# EAGLE design VER2.0 (EAGLE 8.3.2)
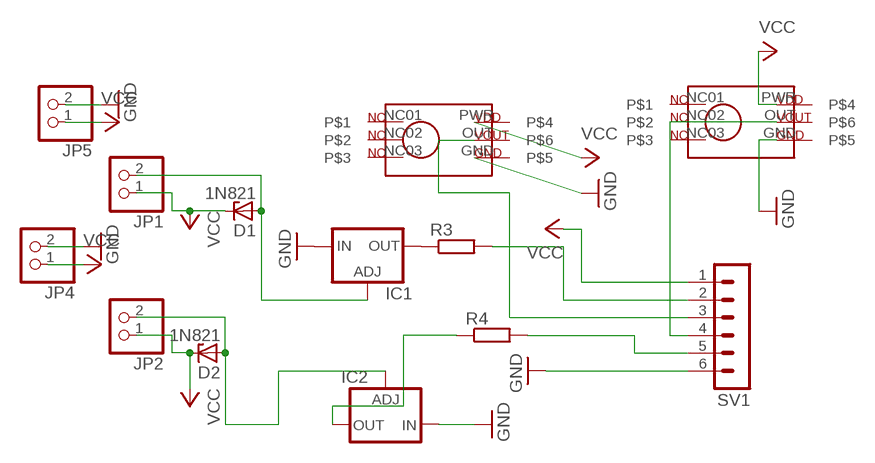
[diagram p0: schematic, sheet 1]

## Parts
D1  1N821  [DO35Z10]
D2  1N821  [DO35Z10]
IC1  LM317TS  [317TS]
IC2  LM317TS  [317TS]
JP1  PINHD-1X2  [1X02]
JP2  PINHD-1X2  [1X02]
JP4  PINHD-1X2  [1X02]
JP5  PINHD-1X2  [1X02]
R3  R-EU_0207/10  [0207/10]
R4  R-EU_0207/10  [0207/10]
SV1  MA06-1  [MA06-1]
U$1  MIS-2500  [MIS-2500]
U$2  MIS-2500  [MIS-2500]

## Nets
GND: IC1.3(IN) IC2.3(IN) JP4.2 JP5.2 SV1.6 U$1.GND U$2.GND
N$1: R3.2 SV1.2
N$2: SV1.3 U$1.OUT
N$3: IC2.2(OUT) R4.1
N$4: D2.A IC2.1(ADJ) JP2.2
N$5: IC1.2(OUT) R3.1
N$6: D1.A IC1.1(ADJ) JP1.2
N$8: SV1.4 U$2.OUT
N$9: R4.2 SV1.5
VCC: D1.C D2.C JP1.1 JP2.1 JP4.1 JP5.1 SV1.1 U$1.PWR U$2.PWR
Unconnected: U$1.NC01 U$1.NC02 U$1.NC03 U$2.NC01 U$2.NC02 U$2.NC03

## Library data of the parts
D1 D2 = diode:1N821: Reference DIODE temperature compensated, 6,2 V
IC1 IC2 = v-reg:LM317TS: VOLTAGE REGULATOR
JP1 JP2 JP4 JP5 = pinhead:PINHD-1X2: PIN HEADER
R3 R4 = resistor:R-EU_: RESISTOR, European symbol
SV1 = con-lstb:MA06-1: PIN HEADER; OC_FARNELL: unknown; OC_NEWARK: unknown
U$1 U$2 = mis-2500:MIS-2500

## Board
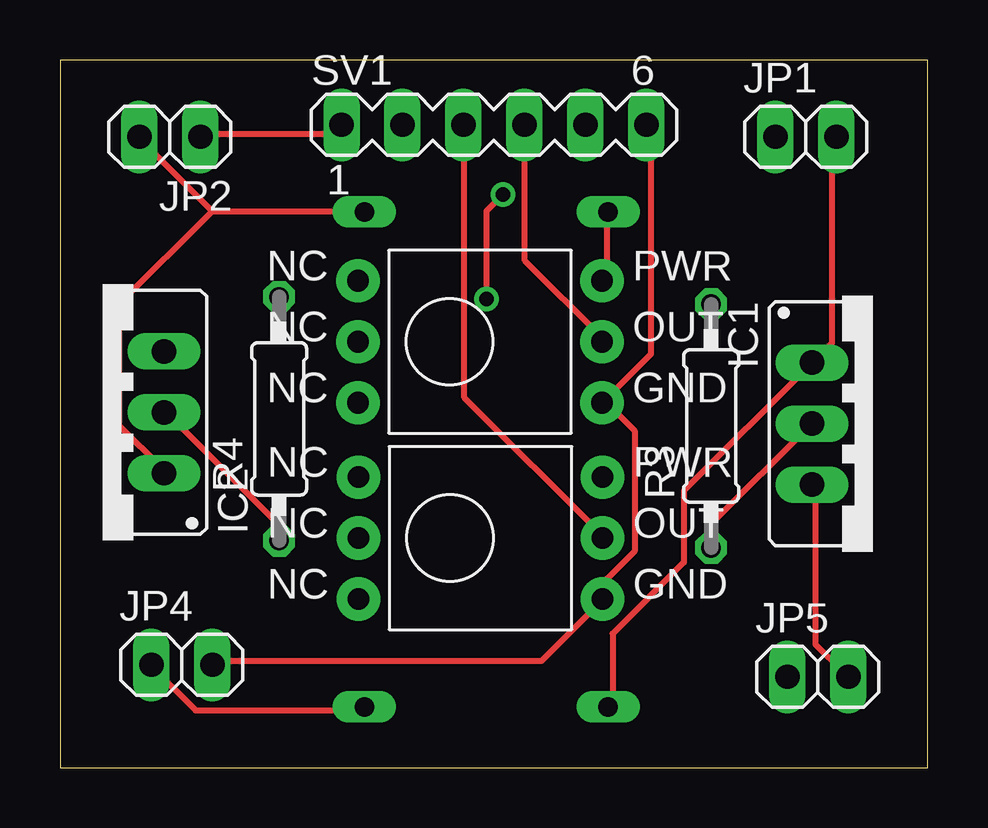
[diagram p1: board, top side]
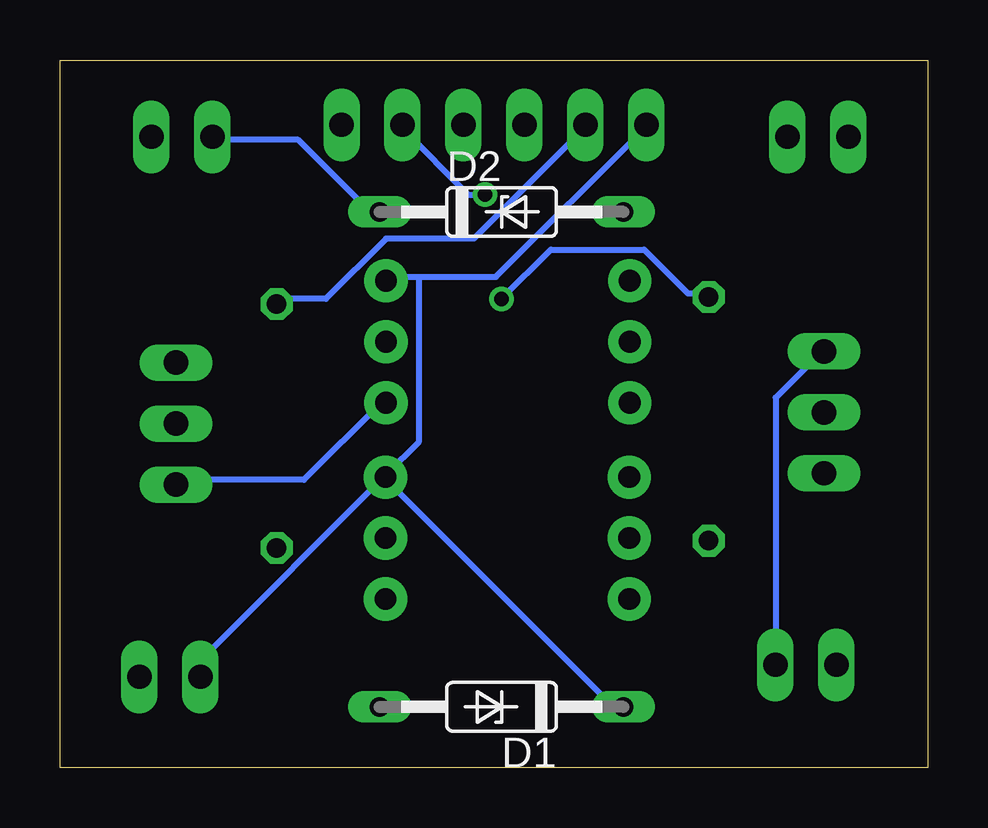
[diagram p2: board, bottom side, seen from below]

Size 36.16 x 29.48 mm. Coordinates in mm from the lower left corner, seen from the top.
Outline: 0,0 36.16,0 36.16,29.48 0,29.48 0,0
Copper layers (1*16): Top 0.035mm / dielectric 1.5mm / Bottom 0.035mm
Design rules "default": minimum track width 10mil, minimum drill 24mil, track to track 8mil, track to pad 8mil, pad to pad 8mil, via to via 8mil, smd to smd 8mil, copper to edge 40mil, drill to drill 8mil, minimum pad ring 10mil, minimum via ring 8mil, stop-mask expansion 4mil, vias tented up to drill 0mil, thermal gap 10mil

### Footprints (pad centres in the part's own frame; a part is rotated, then mirrored left to right if it is on the bottom)
DO35Z10 = drill 0.813 long: A 5.08,0; C -5.08,0
317TS = drill 1.016 long: 1 -2.54,-2.54; 2 0,-2.54; 3 2.54,-2.54
1X02 = drill 1.016 long: 1 -1.27,0; 2 1.27,0
0207/10 = drill 0.813 octagon: 1 -5.08,0; 2 5.08,0
MA06-1 = drill 1.016 long: 1 -6.35,0; 2 -3.81,0; 3 -1.27,0; 4 1.27,0; 5 3.81,0; 6 6.35,0
MIS-2500 = drill 0.9 pad 1.8: GND 0,-5.08; NC01 -10.16,0; NC02 -10.16,-2.54; NC03 -10.16,-5.08; OUT 0,-2.54; PWR 0,0

### Placement (x,y rotation side)
D1  17.76,2.53 180 bottom
D2  17.76,23.15 0 bottom
IC1  33.87,14.33 270 top
IC2  1.79,14.8 90 top
JP1  31.08,26.28 0 top
JP2  4.58,26.28 180 top
JP4  5.08,4.28 0 top
JP5  31.58,3.78 0 top
R3  27.13,14.23 90 top
R4  9.13,14.53 90 top
SV1  18.08,26.78 0 top
U$1  22.6,12.1 0 top
U$2  22.58,20.28 0 top

### Tracks (layer width: path | path; a pad name or v marks a point on that pad's centre or on a via)
GND
  Top 0.254: IC1.3 31.48,11.75 31.48,5.12 32.63,3.98 JP5.2 | SV1.6 24.63,26.61 24.63,17.24 22.8,15.41 U$2.GND 22.8,15.18 23.94,14.04 23.94,9.01 22.8,7.87 22.8,7.18 U$1.GND 22.57,6.95 20.05,4.44 6.57,4.44 JP4.2
  Bottom 0.254: JP4.2 6.34,4.44 6.34,15.41 4.51,17.24 IC2.3 | IC1.3 31.26,11.98 26,11.98 22.8,15.18 U$2.GND
N$1
  Bottom 0.254: R3.2 26.91,19.53 25.08,19.53 22.57,22.04 18.91,22.04 14.34,26.61 SV1.2
N$2
  Top 0.254: SV1.3 16.85,26.61 16.85,15.41 22.57,9.69 U$1.OUT
N$3
  Top 0.254: R4.1 9.08,9.47 9.08,10.15 4.51,14.72 IC2.2
N$4
  Top 0.254: 6.34,23.18 12.51,23.18 D2.A | 6.34,23.18 3.37,26.16 JP2.2 | 6.34,23.18 2.45,19.3 2.45,14.27 4.28,12.44 IC2.1
N$5
  Top 0.254: R3.1 27.14,9.24 27.14,10.15 31.26,14.27 IC1.2
N$6
  Top 0.254: D1.A 23.03,2.61 23.03,5.58 26,8.55 26,11.52 31.26,16.78 IC1.1 31.48,17.01 32.17,17.7 32.17,26.16 JP1.2
N$8
  Top 0.254: SV1.4 19.37,26.61 19.37,21.12 22.57,17.93 U$2.OUT
N$9  (via drill 0.61)
  Top 0.254: v17.77,19.53 17.77,23.18 v18.45,23.87
  Bottom 0.254: v17.77,19.53 15.71,21.58 11.82,21.58 9.99,19.75 9.31,19.75 R4.2 | v18.45,23.87 19.14,23.87 21.88,26.61 SV1.5
VCC
  Top 0.254: JP2.1 5.88,26.38 11.37,26.38 11.6,26.61 SV1.1 | D2.C 22.8,22.95 22.8,20.44 U$2.PWR | D1.C 12.51,2.38 5.65,2.38 3.82,4.21 JP4.1
  Bottom 0.254: JP1.1 29.66,26.16 26.23,26.16 23.03,22.95 D2.C | 21.2,20.44 22.57,20.44 U$2.PWR | 21.2,20.44 18,20.44 11.82,26.61 SV1.1 | JP5.1 30.11,3.98 30.11,4.67 22.8,11.98 U$1.PWR | D1.C 12.74,2.61 13.2,2.61 22.57,11.98 U$1.PWR | 21.2,20.44 21.2,13.58 22.57,12.21 U$1.PWR